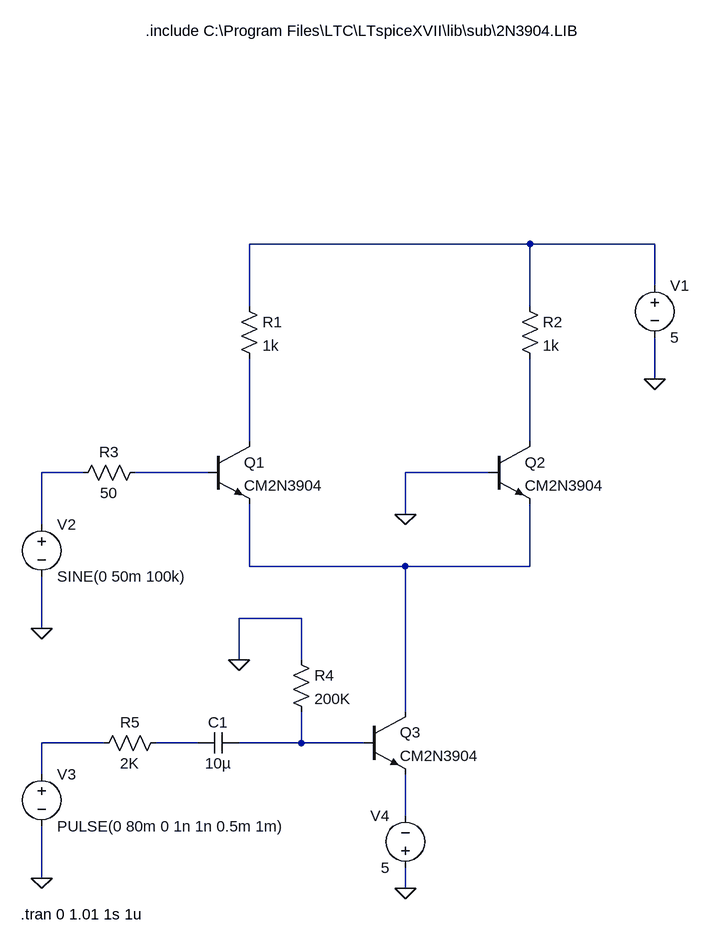
[diagram p0: schematic part 4 circuit square no step.asc]
part 4 circuit square no step.asc, the LTspice schematic file:
Version 4
SHEET 1 1324 1428
WIRE 480 368 48 368
WIRE 672 368 480 368
WIRE 672 432 672 368
WIRE 48 464 48 368
WIRE 480 464 480 368
WIRE 672 576 672 512
WIRE 48 672 48 544
WIRE 480 672 480 544
WIRE -208 720 -272 720
WIRE -16 720 -128 720
WIRE 416 720 288 720
WIRE 288 784 288 720
WIRE -272 800 -272 720
WIRE 48 864 48 768
WIRE 288 864 48 864
WIRE 480 864 480 768
WIRE 480 864 288 864
WIRE 128 944 32 944
WIRE -272 960 -272 880
WIRE 32 1008 32 944
WIRE 128 1008 128 944
WIRE 288 1088 288 864
WIRE -176 1136 -272 1136
WIRE -32 1136 -96 1136
WIRE 128 1136 128 1088
WIRE 128 1136 32 1136
WIRE 224 1136 128 1136
WIRE -272 1184 -272 1136
WIRE 288 1248 288 1184
WIRE -272 1344 -272 1264
WIRE 288 1360 288 1328
FLAG 288 784 0
FLAG 672 576 0
FLAG -272 960 0
FLAG 32 1008 0
FLAG -272 1344 0
FLAG 288 1360 0
SYMBOL res 32 448 R0
SYMATTR InstName R1
SYMATTR Value 1k
SYMBOL res 464 448 R0
SYMATTR InstName R2
SYMATTR Value 1k
SYMBOL npn -16 672 R0
SYMATTR InstName Q1
SYMATTR Value CM2N3904
SYMBOL npn 416 672 R0
SYMATTR InstName Q2
SYMATTR Value CM2N3904
SYMBOL res -112 704 R90
WINDOW 0 0 56 VBottom 2
WINDOW 3 32 56 VTop 2
SYMATTR InstName R3
SYMATTR Value 50
SYMBOL voltage 672 416 R0
SYMATTR InstName V1
SYMATTR Value 5
SYMBOL npn 224 1088 R0
SYMATTR InstName Q3
SYMATTR Value CM2N3904
SYMBOL voltage -272 784 R0
WINDOW 123 0 0 Left 0
WINDOW 39 0 0 Left 0
SYMATTR InstName V2
SYMATTR Value SINE(0 50m 100k)
SYMBOL cap 32 1120 R90
WINDOW 0 0 32 VBottom 2
WINDOW 3 32 32 VTop 2
SYMATTR InstName C1
SYMATTR Value 10µ
SYMBOL res 112 992 R0
SYMATTR InstName R4
SYMATTR Value 200K
SYMBOL res -80 1120 R90
WINDOW 0 0 56 VBottom 2
WINDOW 3 32 56 VTop 2
SYMATTR InstName R5
SYMATTR Value 2K
SYMBOL voltage -272 1168 R0
WINDOW 123 0 0 Left 0
WINDOW 39 0 0 Left 0
SYMATTR InstName V3
SYMATTR Value PULSE(0 80m 0 1n 1n 0.5m 1m)
SYMBOL voltage 288 1344 R180
WINDOW 0 24 96 Left 2
WINDOW 3 24 16 Left 2
SYMATTR InstName V4
SYMATTR Value 5
TEXT -304 1400 Left 2 !.tran 0 1.01 1s 1u
TEXT -112 40 Left 2 !.include C:\\Program Files\\LTC\\LTspiceXVII\\lib\\sub\\2N3904.LIB

The netlist it stands for:
* part 4 circuit square no step.asc
R1 N001 N002 1k
R2 N001 N003 1k
Q1 N002 N005 N006 0 CM2N3904
Q2 N003 0 N006 0 CM2N3904
R3 N005 N004 50
V1 N001 0 5
Q3 N006 N009 N010 0 CM2N3904
V2 N004 0 SINE(0 50m 100k)
C1 N009 N008 10µ
R4 0 N009 200K
R5 N008 N007 2K
V3 N007 0 PULSE(0 80m 0 1n 1n 0.5m 1m)
V4 0 N010 5
.model NPN NPN
.model PNP PNP
.lib standard.bjt
.tran 0 1.01 1s 1u
.include C:\Program Files\LTC\LTspiceXVII\lib\sub\2N3904.LIB
.backanno
.end